# Altium schematic sheet OPAMP_TESTER_1.SchDoc
size A4; SheetNumber: 2; SheetTotal: 4
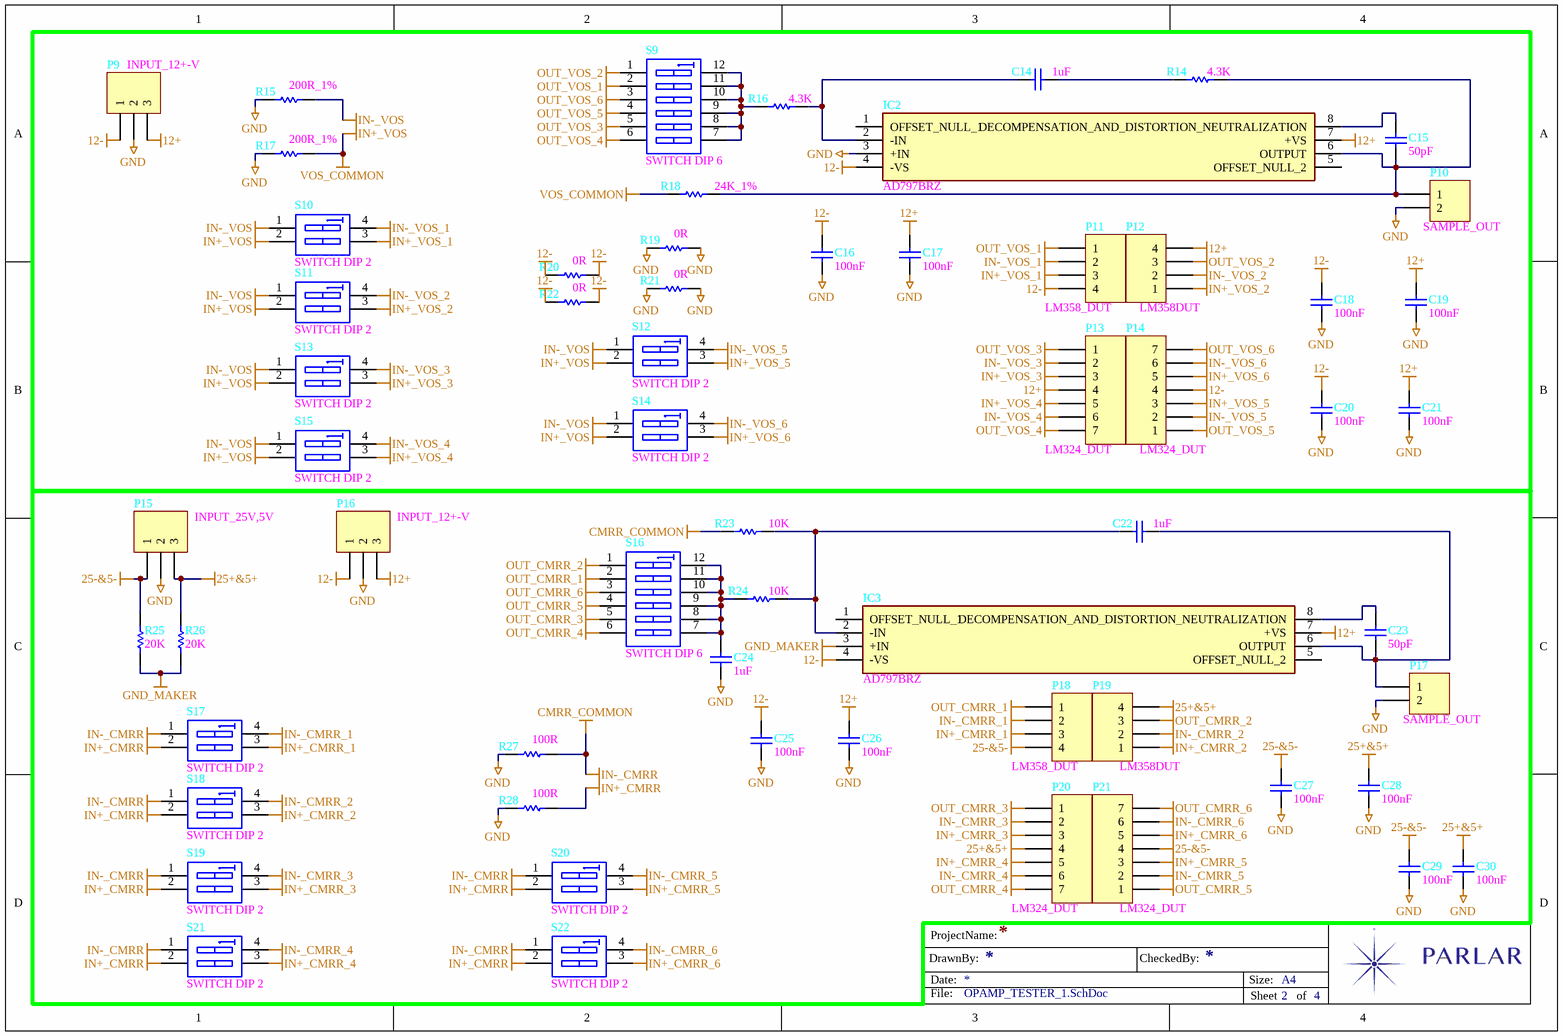
[diagram p0: OPAMP_TESTER_1.SchDoc]

## Parts
C14  1uF  [SMD 1206]
C15  50pF  [SMD 1206]
C16  100nF  [SMD 0805]
C17  100nF  [SMD 0805]
C18  100nF  [SMD 0805]
C19  100nF  [SMD 0805]
C20  100nF  [SMD 0805]
C21  100nF  [SMD 0805]
C22  1uF  [SMD 1206]
C23  50pF  [SMD 1206]
C24  1uF  [SMD 0805]
C25  100nF  [SMD 0805]
C26  100nF  [SMD 0805]
C27  100nF  [SMD 0805]
C28  100nF  [SMD 0805]
C29  100nF  [SMD 0805]
C30  100nF  [SMD 0805]
IC2  AD797BRZ  [SOIC127P600X175-8N]
IC3  AD797BRZ  [SOIC127P600X175-8N]
P9  INPUT_12+-V  [CON XH 3]
P10  SAMPLE_OUT  [CON XH 2]
P11  LM358_DUT  [CON HDR 2.54FM 4]
P12  LM358DUT  [CON HDR 2.54FM 4]
P13  LM324_DUT  [CON HDR 2.54FM 7]
P14  LM324_DUT  [CON HDR 2.54FM 7]
P15  INPUT_25V,5V  [CON XH 3]
P16  INPUT_12+-V  [CON XH 3]
P17  SAMPLE_OUT  [CON XH 2]
P18  LM358_DUT  [CON HDR 2.54FM 4]
P19  LM358DUT  [CON HDR 2.54FM 4]
P20  LM324_DUT  [CON HDR 2.54FM 7]
P21  LM324_DUT  [CON HDR 2.54FM 7]
R14  4.3K  [SMD 0805]
R15  200R_1%  [SMD 0805]
R16  4.3K  [SMD 1206]
R17  200R_1%  [SMD 0805]
R18  24K_1%  [SMD 0805]
R19  0R  [SMD 1206]
R20  0R  [SMD 1206]
R21  0R  [SMD 1206]
R22  0R  [SMD 1206]
R23  10K  [SMD 0805]
R24  10K  [SMD 0805]
R25  20K  [SMD 0805]
R26  20K  [SMD 0805]
R27  100R  [SMD 0805]
R28  100R  [SMD 0805]
S9  SWITCH DIP 6  [SWITCH DIP 6]
S10  SWITCH DIP 2  [SWITCH DIP 2]
S11  SWITCH DIP 2  [SWITCH DIP 2]
S12  SWITCH DIP 2  [SWITCH DIP 2]
S13  SWITCH DIP 2  [SWITCH DIP 2]
S14  SWITCH DIP 2  [SWITCH DIP 2]
S15  SWITCH DIP 2  [SWITCH DIP 2]
S16  SWITCH DIP 6  [SWITCH DIP 6]
S17  SWITCH DIP 2  [SWITCH DIP 2]
S18  SWITCH DIP 2  [SWITCH DIP 2]
S19  SWITCH DIP 2  [SWITCH DIP 2]
S20  SWITCH DIP 2  [SWITCH DIP 2]
S21  SWITCH DIP 2  [SWITCH DIP 2]
S22  SWITCH DIP 2  [SWITCH DIP 2]

## Nets
12+: C17.2 C19.2 C21.2 C26.2 IC2.7(+VS) IC3.7(+VS) P9.3 P12.4 P13.4 P16.3
12-: C16.2 C18.2 C20.2 C25.2 IC2.4(-VS) IC3.4(-VS) P9.1 P11.4 P14.4 P16.1 R20.1 R20.2 R22.1 R22.2
25+&5+: C28.2 C30.2 P15.3 P19.4 P20.4 R26.2
25-&5-: C27.2 C29.2 P15.1 P18.4 P21.4 R25.2
CMRR_COMMON: R23.1 R27.2 S17.1(A1) S18.1(A1) S19.1(A1) S20.1(A1) S21.1(A1) S22.1(A1)  [also labelled IN-_CMRR]
GND: C16.1 C17.1 C18.1 C19.1 C20.1 C21.1 C24.1 C25.1 C26.1 C27.1 C28.1 C29.1 C30.1 IC2.3(+IN) P9.2 P10.2 P15.2 P16.2 P17.2 R15.1 R17.1 R19.1 R19.2 R21.1 R21.2 R27.1 R28.1
GND_MAKER: IC3.3(+IN) R25.1 R26.1
IN+_CMRR: R28.2 S17.2(A2) S18.2(A2) S19.2(A2) S20.2(A2) S21.2(A2) S22.2(A2)
IN+_CMRR_1: P18.3 S17.3(B2)
IN+_CMRR_2: P19.1 S18.3(B2)
IN+_CMRR_3: P20.3 S19.3(B2)
IN+_CMRR_4: P20.5 S21.3(B2)
IN+_CMRR_5: P21.3 S20.3(B2)
IN+_CMRR_6: P21.5 S22.3(B2)
IN+_VOS: R17.2 R18.1 S10.2(A2) S11.2(A2) S12.2(A2) S13.2(A2) S14.2(A2) S15.2(A2)  [also labelled VOS_COMMON]
IN+_VOS_1: P11.3 S10.3(B2)
IN+_VOS_2: P12.1 S11.3(B2)
IN+_VOS_3: P13.3 S13.3(B2)
IN+_VOS_4: P13.5 S15.3(B2)
IN+_VOS_5: P14.3 S12.3(B2)
IN+_VOS_6: P14.5 S14.3(B2)
IN-_CMRR_1: P18.2 S17.4(B1)
IN-_CMRR_2: P19.2 S18.4(B1)
IN-_CMRR_3: P20.2 S19.4(B1)
IN-_CMRR_4: P20.6 S21.4(B1)
IN-_CMRR_5: P21.2 S20.4(B1)
IN-_CMRR_6: P21.6 S22.4(B1)
IN-_VOS: R15.2 S10.1(A1) S11.1(A1) S12.1(A1) S13.1(A1) S14.1(A1) S15.1(A1)
IN-_VOS_1: P11.2 S10.4(B1)
IN-_VOS_2: P12.2 S11.4(B1)
IN-_VOS_3: P13.2 S13.4(B1)
IN-_VOS_4: P13.6 S15.4(B1)
IN-_VOS_5: P14.2 S12.4(B1)
IN-_VOS_6: P14.6 S14.4(B1)
OUT_CMRR_1: P18.1 S16.2(A2)
OUT_CMRR_2: P19.3 S16.1(A1)
OUT_CMRR_3: P20.1 S16.5(A5)
OUT_CMRR_4: P20.7 S16.6(A6)
OUT_CMRR_5: P21.1 S16.4(A4)
OUT_CMRR_6: P21.7 S16.3(A3)
OUT_VOS_1: P11.1 S9.2(A2)
OUT_VOS_2: P12.3 S9.1(A1)
OUT_VOS_3: P13.1 S9.5(A5)
OUT_VOS_4: P13.7 S9.6(A6)
OUT_VOS_5: P14.1 S9.4(A4)
OUT_VOS_6: P14.7 S9.3(A3)
NetC14_1: C14.1 R14.1
NetC14_2: C14.2 IC2.2(-IN) R16.2
NetC15_1: C15.1 IC2.8(DECOMPENSATION_AND_DISTORTION_NEUTRALIZATION)
NetC15_2: C15.2 IC2.6(OUTPUT) P10.1 R14.2 R18.2
NetC22_1: C22.1 C23.2 IC3.6(OUTPUT) P17.1
NetC22_2: C22.2 IC3.2(-IN) R23.2 R24.2
NetC23_1: C23.1 IC3.8(DECOMPENSATION_AND_DISTORTION_NEUTRALIZATION)
NetC24_2: C24.2 R24.1 S16.7(B6) S16.8(B5) S16.9(B4) S16.10(B3) S16.11(B2) S16.12(B1)
NetR16_1: R16.1 S9.7(B6) S9.8(B5) S9.9(B4) S9.10(B3) S9.11(B2) S9.12(B1)

Not connected (* = marked no-connect by the designer): IC2 1(OFFSET_NULL_1) 5(OFFSET_NULL_2); IC3 1(OFFSET_NULL_1) 5(OFFSET_NULL_2)

## Notes on the sheet
- DrawnBy:
- ProjectName:
- Date:
- CheckedBy:
- Size:
- A4
- File:
- Sheet
- of

## Library data of the parts
C14-C30 = CAP: Capacitor; Published: 8-Jun-2000; LatestRevisionDate: 17-Jul-2002; LatestRevisionNote: Re-released for DXP Platform.; PackageReference: RAD-0.3; Publisher: Altium Limited; PackageDescription: Radial Cap, Thru-Hole; 2 Leads; 0.3 in Pin Spacing
IC2 IC3 = AD797BRZ: Integrated Circuit; Manufacturer_Name: Analog Devices; Datasheet Link: http://www.analog.com/static/imported-files/data_sheets/AD797.pdf; Height: 1.75mm; Manufacturer_Part_Number: AD797BRZ; Mouser Part Number: 584-AD797BRZ; Mouser Price/Stock: https://www.mouser.co.uk/ProductDetail/Analog-Devices/AD797BRZ?qs=%2FtpEQrCGXCwnXZ1Ropaiug%3D%3D; Arrow Part Number: AD797BRZ; Arrow Price/Stock: https://www.arrow.com/en/products/ad797brz/analog-devices?region=nac
P9 P15 P16 = CONNECTOR 3: Header, 3-Pin; LatestRevisionDate: 17-Jul-2002; LatestRevisionNote: Re-released for DXP Platform.; Publisher: Altium Limited
P10 P17 = CONNECTOR 2: Header, 2-Pin; LatestRevisionDate: 17-Jul-2002; LatestRevisionNote: Re-released for DXP Platform.; Publisher: Altium Limited
P11 P12 P18 P19 = CONNECTOR 4: Header, 4-Pin; LatestRevisionDate: 17-Jul-2002; LatestRevisionNote: Re-released for DXP Platform.; Publisher: Altium Limited
P13 P14 P20 P21 = CONNECTOR 7: Header, 7-Pin; LatestRevisionDate: 17-Jul-2002; LatestRevisionNote: Re-released for DXP Platform.; Publisher: Altium Limited
R14-R28 = RES: Resistor
S9 S16 = SWITCH DIP 6: DIP Switch, 6 Position, SPST; Published: 24-Mar-1999; LatestRevisionDate: 17-Jul-2002; LatestRevisionNote: Re-released for DXP Platform.; PackageReference: DIP-12/SW; Publisher: Altium Limited; PackageDescription: DIP Switch; 12 Leads
S10-S15 S17-S22 = SWITCH DIP 2: DIP Switch, 2 Position, SPST; Published: 24-Mar-1999; LatestRevisionDate: 17-Jul-2002; LatestRevisionNote: Re-released for DXP Platform.; PackageReference: DIP-4; Publisher: Altium Limited